# Altium schematic sheet 1_P1.schdoc
size 307 x 218 mm; Symbol: Sheet-Symbol_A4; Device: Sheet-Symbol_A4; Company: 嘉立创EDA; Version: V1.0; Page Size: A4; @Project Name: 250628 ESP32底板改版 120; @Page Count: 1; @Update Date: 2025-06-28; @Create Date: 2025-06-28; @Schematic Name: Schematic1_1; @Page No: 1; @Page Name: P1; Title Block Position: 3; Width: 1170; Height: 825; Region Start: 1; X Region Count: 6; Y Region Count: 4; Blade Width: 10; @Board Name: Board1_1; @Create Time: 22:15:55; @Update Time: 22:31:45
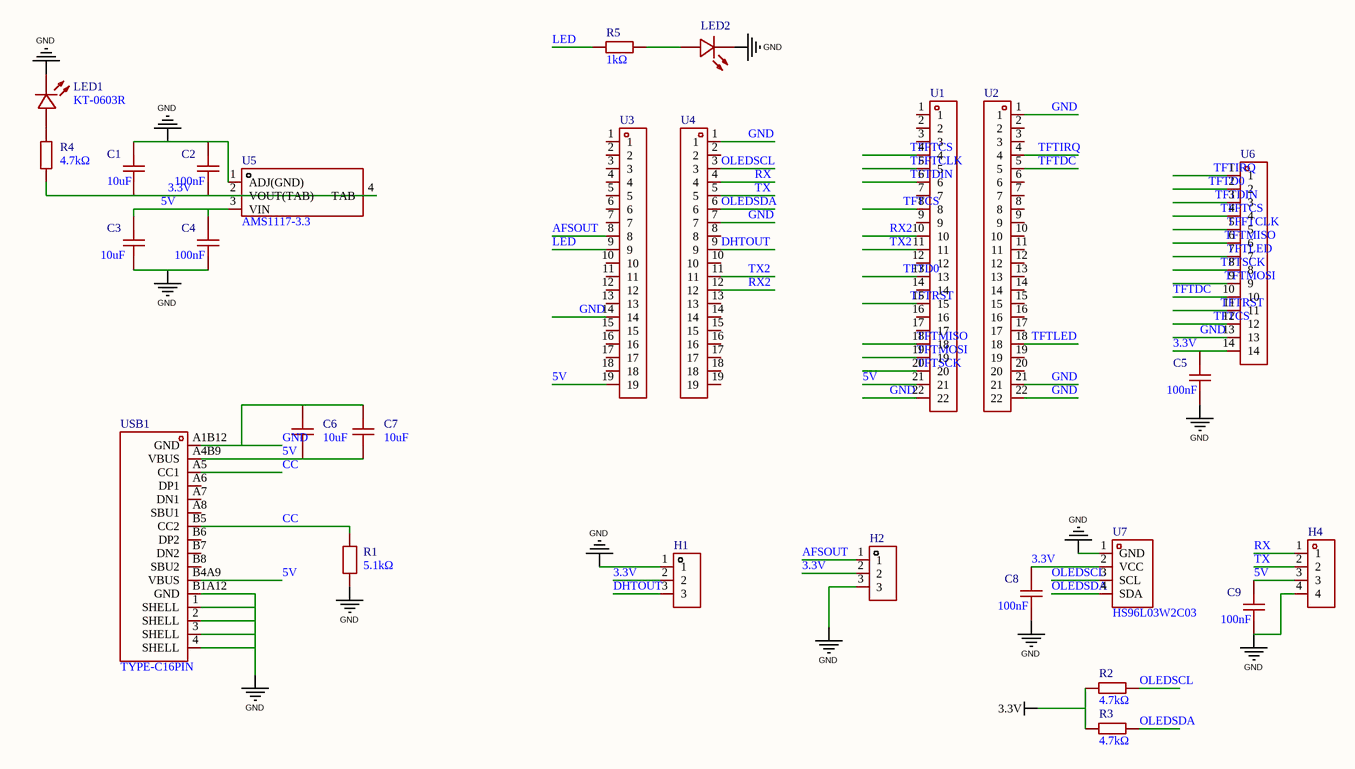
[diagram p0: 1_P1.schdoc]

## Parts
C1  10uF  [C0603]
C2  100nF  [C0603]
C3  10uF  [C0603]
C4  100nF  [C0603]
C5  100nF  [C0603]
C6  10uF  [C0603]
C7  10uF  [C0603]
C8  100nF  [C0603]
C9  100nF  [C0603]
H1  PM254V-11-03-H85  [HDR-TH_3P-P2.54-V-F]  (value not drawn)
H2  PM254V-11-03-H85  [HDR-TH_3P-P2.54-V-F]  (value not drawn)
H4  PZ254V-11-04P  [HDR-TH_4P-P2.54-V-M]  (value not drawn)
LED1  KT-0603R  [LED0603-RD]
LED2  KT-0603R  [LED0603-RD]  (value not drawn)
R1  5.1kΩ  [R0603]
R2  4.7kΩ  [R0603]
R3  4.7kΩ  [R0603]
R4  4.7kΩ  [R0603]
R5  1kΩ  [R0603]
U1  ZX-PM2.54-1-22PY  [HDR-TH_22P-P2.54-V-F]  (value not drawn)
U2  ZX-PM2.54-1-22PY  [HDR-TH_22P-P2.54-V-F]  (value not drawn)
U3  ZX-PM2.54-1-19PY  [HDR-TH_19P-P2.54-V-F]  (value not drawn)
U4  ZX-PM2.54-1-19PY  [HDR-TH_19P-P2.54-V-F]  (value not drawn)
U5  AMS1117-3.3  [SOT-223-4_L6.5-W3.5-P2.30-LS7.0-BR]
U6  PM254-1-14-Z-8.5  [HDR-TH_14P-P2.54-V-F-1]  (value not drawn)
U7  HS96L03W2C03  [OLED-TH_L27.8-W27.2-P2.54_C9900033791]
USB1  TYPE-C16PIN  [USB-C-SMD_TYPE-C16PIN]

## Nets
3.3V: C1.1 C2.1 C5.2 C8.2 H1.2 H2.2 R2.2 R3.2 R4.2 U5.2(VOUT(TAB)) U5.4(TAB) U6.14 U7.2(VCC)
GND: C1.2 C2.2 C3.1 C4.1 C5.1 C6.1 C7.1 C8.1 C9.1 H1.1 H2.3 H4.4 LED1.1(K) LED2.1(K) R1.1 U1.22 U2.1 U2.21 U2.22 U3.14 U4.1 U4.7 U5.1(ADJ(GND)) U6.13 U7.1(GND) USB1.1(SHELL) USB1.2(SHELL) USB1.3(SHELL) USB1.4(SHELL) USB1.A1B12(GND) USB1.B1A12(GND)
5V: C3.2 C4.2 C6.2 C7.2 C9.2 H4.3 U1.21 U3.19 U5.3(VIN) USB1.A4B9(VBUS) USB1.B4A9(VBUS)
AFSOUT: H2.1 U3.8
CC: R1.2 USB1.A5(CC1) USB1.B5(CC2)
DHTOUT: H1.3 U4.9
LED: R5.1 U3.9
OLEDSCL: R2.1 U4.3 U7.3(SCL)
OLEDSDA: R3.1 U4.6 U7.4(SDA)
RX: H4.1 U4.4
RX2: U1.10 U4.12
TFFTCLK: U1.5 U6.5
TFFTCS: U1.4 U6.4
TFTCS: U1.8 U6.12
TFTD0: U1.13 U6.2
TFTDC: U2.5 U6.10
TFTDIN: U1.6 U6.3
TFTIRQ: U2.4 U6.1
TFTLED: U2.18 U6.7
TFTMISO: U1.18 U6.6
TFTMOSI: U1.19 U6.9
TFTRST: U1.15 U6.11
TFTSCK: U1.20 U6.8
TX: H4.2 U4.5
TX2: U1.11 U4.11
NetLED1_2: LED1.2(A) R4.1
NetLED2_2: LED2.2(A) R5.2

Not connected (* = marked no-connect by the designer): U1 1 2 3 7 9 12 14 16 17; U2 2 3 6 7 8 9 10 11 12 13 14 15 16 17 19 20; U3 1 2 3 4 5 6 7 10 11 12 13 15 16 17 18; U4 2 8 10 13 14 15 16 17 18 19; USB1 A6(DP1) A7(DN1) A8(SBU1) B6(DP2) B7(DN2) B8(SBU2)

## Notes on the sheet
- 1
- 2
- 3
- 4
- 5
- 6
- A
- B
- C
- 原理图
- Schematic1_1
- 创建日期
- 更新日期
- 2025-06-28
- 绘制
- 图页
- P1
- 物料编码
- D
- 审阅
- 版本
- 尺寸
- 250628 ESP32底板改版 120
- 页
- 共
- V1.0
- A4
- 嘉立创EDA

## Library data of the parts
C1 C3 C6 C7 = CL10A106KP8NNNC: Manufacturer: SAMSUNG(三星); Add into BOM: yes; Tolerance: ±10%; Voltage Rated: 10V; Temperature Coefficient: X5R; Symbol: CL10A106KP8NNNC; Device: CL10A106KP8NNNC; LCSC Part Name: 10uF ±10% 10V; Supplier Part: C19702; Manufacturer Part: CL10A106KP8NNNC; Supplier Footprint: 0603; JLCPCB Part Class: 基础库; Datasheet: https://atta.szlcsc.com/upload/public/pdf/source/20160218/1457707763339.pdf; Supplier: LCSC; Convert to PCB: yes; Value: 10uF
C2 C4 C5 C8 C9 = CC0603KRX7R9BB104: Manufacturer: YAGEO(国巨); Add into BOM: yes; Tolerance: ±10%; Voltage Rated: 50V; Temperature Coefficient: X7R; Symbol: CC0603KRX7R9BB104; Device: CC0603KRX7R9BB104; LCSC Part Name: 100nF ±10% 50V; Supplier Part: C14663; Manufacturer Part: CC0603KRX7R9BB104; Supplier Footprint: 0603; JLCPCB Part Class: 基础库; Datasheet: https://atta.szlcsc.com/upload/public/pdf/source/20180910/C282072_33301C7F631E79921B82A8DAC6BCC5B3.pdf; Supplier: LCSC; Convert to PCB: yes; Value: 100nF
H1 H2 = PM254V-11-03-H85: Manufacturer: XFCN(兴飞); Add into BOM: yes; Holes Structure: 1x3P; Pitch: 2.54mm; Number of Holes: 3P; Symbol: PM254V-11-03-H85; Device: PM254V-11-03-H85; LCSC Part Name: 间距:2.54mm 1x3P 直插; Supplier Part: C541850; Manufacturer Part: PM254V-11-03-H85; Supplier Footprint: 插件,P=2.54mm; JLCPCB Part Class: 扩展库; Datasheet: https://atta.szlcsc.com/upload/public/pdf/source/20200518/C541849_85853D71FC67C51915A806977A588FDA.pdf; Supplier: LCSC; Convert to PCB: yes; Row Spacing: -; Mounting Type: 直插; Number of Rows: 单排; Insulation Height: -; Contact Material: 黄铜; Contact Plating: -
H4 = PZ254V-11-04P: Manufacturer: XFCN(兴飞); Symbol: PZ254V-11-04P_C2691448; Add into BOM: yes; Pin Structure: 1x4P; Pitch: 2.54mm; Circluar Pins/Square Pins: 方针; Current Rating (Max): 3A; Voltage Rating (Max): 250V; Device: PZ254V-11-04P; LCSC Part Name: 间距:2.54mm 1x4P 直插 方针; Supplier Part: C2691448; Manufacturer Part: PZ254V-11-04P; Supplier Footprint: 插件,P=2.54mm; JLCPCB Part Class: 扩展库; Datasheet: https://atta.szlcsc.com/upload/public/pdf/source/20200309/C492403_F9F19131791D08044AD4F84F8E751A34.pdf; Supplier: LCSC; Convert to PCB: yes; Row Spacing: -; Mounting Type: 直插; Number of Rows: 单排; Number of Pins: 4P; Length of Mating Pin: 6mm; Insulation Height: 2.5mm; Length of End Connection Pin: 3mm; Contact Material: -; Operating Temperature Range: -40℃~+105℃; Color: 黑色
LED1 LED2 = KT-0603R: Manufacturer: KENTO; Add into BOM: yes; Emitted Color: 红色; Symbol: KT-0603R; Device: KT-0603R; LCSC Part Name: 0603 红灯 高亮; Supplier Part: C2286; Manufacturer Part: KT-0603R; Supplier Footprint: 0603; JLCPCB Part Class: Basic Part; Datasheet: https://atta.szlcsc.com/upload/public/pdf/source/20160616/1466072038404.pdf; Supplier: LCSC; Convert to PCB: yes; Power Dissipation: -; Forward Current: -; Dominant Wavelength: -; Peak Wavelength: -; Diode Configuration: -; Lens Color: -; Color Temperature: -; Viewing Angle: -; Mounting Sytle: -; Operating Temperature: -40℃~+85℃
R1 = FRC0603F5101TS: Manufacturer: FOJAN(富捷); Add into BOM: yes; Tolerance: ±1%; Power(Watts): 100mW; Overload Voltage (Max): 75V; Temperature Coefficient: ±100ppm/℃; Symbol: FRC0603F5101TS; Device: FRC0603F5101TS; LCSC Part Name: 5.1kΩ ±1% 100mW 厚膜电阻; Supplier Part: C2907044; Manufacturer Part: FRC0603F5101TS; Supplier Footprint: 0603; JLCPCB Part Class: 扩展库; Datasheet: https://atta.szlcsc.com/upload/public/pdf/source/20211221/925EC7D7225764EE0046F22065062C87.pdf; Supplier: LCSC; Convert to PCB: yes; Type: 厚膜电阻; Value: 5.1kΩ; Operating Temperature Range: -55℃~+155℃
R2-R4 = 0603WAF4701T5E: Manufacturer: UNI-ROYAL(厚声); Add into BOM: yes; Tolerance: ±1%; Power(Watts): 100mW; Overload Voltage (Max): 75V; Temperature Coefficient: ±100ppm/℃; Symbol: 0603WAF4701T5E; Device: 0603WAF4701T5E; LCSC Part Name: 4.7kΩ ±1% 100mW 厚膜电阻; Supplier Part: C23162; Manufacturer Part: 0603WAF4701T5E; Supplier Footprint: 0603; JLCPCB Part Class: 基础库; Datasheet: https://atta.szlcsc.com/upload/public/pdf/source/20200306/C422600_1E6D84923E4A46A82E41ADD87F860B5C.pdf; Supplier: LCSC; Convert to PCB: yes; Type: 厚膜电阻; Value: 4.7kΩ; Operating Temperature Range: -55℃~+155℃
R5 = 0603WAF1001T5E: Manufacturer: UNI-ROYAL(厚声); Add into BOM: yes; Tolerance: ±1%; Power(Watts): 100mW; Overload Voltage (Max): 75V; Temperature Coefficient: ±100ppm/℃; Symbol: 0603WAF1001T5E; Device: 0603WAF1001T5E; LCSC Part Name: 1kΩ ±1% 100mW 厚膜电阻; Supplier Part: C21190; Manufacturer Part: 0603WAF1001T5E; Supplier Footprint: 0603; JLCPCB Part Class: 基础库; Datasheet: https://atta.szlcsc.com/upload/public/pdf/source/20200306/C422600_1E6D84923E4A46A82E41ADD87F860B5C.pdf; Supplier: LCSC; Convert to PCB: yes; Type: 厚膜电阻; Value: 1kΩ; Operating Temperature Range: -55℃~+155℃
U1 U2 = ZX-PM2.54-1-22PY: Manufacturer: Megastar(兆星); Add into BOM: yes; Holes Structure: 1x22P; Pitch: 2.54mm; Circular Hole / Square Hole: 方孔; Number of Holes: 22P; Voltage Rating (Max): 1kV; Holes Direction: 顶部; Soldering Temperature(Max): 260℃@5S; Symbol: ZX-PM2.54-1-22PY; Device: ZX-PM2.54-1-22PY; LCSC Part Name: 1x22P 间距:2.54mm 直插; Supplier Part: C7499337; Manufacturer Part: ZX-PM2.54-1-22PY; Supplier Footprint: 插件,P=2.54mm; JLCPCB Part Class: 扩展库; Datasheet: https://atta.szlcsc.com/upload/public/pdf/source/20231122/9A7AD1561672B326C4FDCF441604BC5A.pdf; Supplier: LCSC; Convert to PCB: yes; Row Spacing: -; Mounting Type: 直插; Number of Rows: 单排; Current Rating (Max): -; Insulation Height: 8.5mm; Contact Material: -; Contact Plating: 金; Operating Temperature Range: -40℃~+105℃
U3 U4 = ZX-PM2.54-1-19PY: Manufacturer: Megastar(兆星); Add into BOM: yes; Holes Structure: 1x19P; Pitch: 2.54mm; Circular Hole / Square Hole: 方孔; Number of Holes: 19P; Voltage Rating (Max): 1kV; Holes Direction: 顶部; Soldering Temperature(Max): 260℃@5S; Symbol: ZX-PM2.54-1-19PY; Device: ZX-PM2.54-1-19PY; LCSC Part Name: 1x19P 间距:2.54mm 直插; Supplier Part: C7499335; Manufacturer Part: ZX-PM2.54-1-19PY; Supplier Footprint: 插件,P=2.54mm; JLCPCB Part Class: 扩展库; Datasheet: https://atta.szlcsc.com/upload/public/pdf/source/20231122/4278E7E0F459AC6498D87D14C0E11918.pdf; Supplier: LCSC; Convert to PCB: yes; Row Spacing: -; Mounting Type: 直插; Number of Rows: 单排; Current Rating (Max): -; Insulation Height: 8.5mm; Contact Material: -; Contact Plating: 金; Operating Temperature Range: -40℃~+105℃
U5 = AMS1117-3.3_C347222: Manufacturer: UMW(友台半导体); Add into BOM: yes; Output Type: 固定; Voltage - Supply: 12V; Output Voltage: 3.3V; Output Current: 1A; Power Supply Rejection Ratio (PSRR): 60dB@(120Hz); Voltage Dropout: 1.3V@(1A); Output Configuration: 正极; Number of Outputs: 1; Symbol: AMS1117-3.3_C347222; Device: AMS1117-3.3_C347222; LCSC Part Name: 输出:3.3V 电流:1A 耐压:12V; Supplier Part: C347222; Manufacturer Part: AMS1117-3.3; Supplier Footprint: SOT-223; JLCPCB Part Class: 扩展库; Datasheet: https://atta.szlcsc.com/upload/public/pdf/source/20241218/BAF0263FA2E44BCD8AF41AA4FA04EFAA.pdf; Supplier: LCSC; Convert to PCB: yes; standby current: -; Noise: -; Features: 过流保护; Operating Temperature: -
U6 = PM254-1-14-Z-8.5: Manufacturer: HCTL(华灿天禄); Add into BOM: yes; Holes Structure: 1x14P; Pitch: 2.54mm; Circular Hole / Square Hole: 方孔; Number of Holes: 14P; Current Rating (Max): 3A; Holes Direction: 顶部; Soldering Temperature(Max): 260℃@5S; Symbol: PM254-1-14-Z-8.5; Device: PM254-1-14-Z-8.5; LCSC Part Name: 1x14P 间距:2.54mm 直插; Supplier Part: C2897377; Manufacturer Part: PM254-1-14-Z-8.5; Supplier Footprint: 插件,P=2.54mm; JLCPCB Part Class: 扩展库; Datasheet: https://atta.szlcsc.com/upload/public/pdf/source/20230609/534BE42964C679BDE98E061007C4ABD6.pdf; Supplier: LCSC; Convert to PCB: yes; Row Spacing: -; Mounting Type: 直插; Number of Rows: 单排; Voltage Rating (Max): -; Insulation Height: 8.5mm; Contact Material: 铜合金; Operating Temperature Range: -40℃~+105℃
U7 = HS96L03W2C03: Manufacturer: HS(汉昇); Add into BOM: yes; Main Control Chip: SSD1315; Interface Type: I2C; Pixel Resolution: 128x64; Symbol: HS96L03W2C03; Device: HS96L03W2C03; LCSC Part Name: 0.96寸OLED显示屏窄白光IIC; Supplier Part: C5248080; Manufacturer Part: HS96L03W2C03; Supplier Footprint: -; JLCPCB Part Class: 扩展库; Datasheet: https://atta.szlcsc.com/upload/public/pdf/source/20230627/763D01F79A90007632F098068C7C8AD9.pdf; Supplier: LCSC; Convert to PCB: yes; Size: 0.96; Operating Temperature: -40℃~+70℃
USB1 = TYPE-C16PIN: Manufacturer: SHOU HAN(首韩); Add into BOM: yes; Connector Type: Type-C; Gender: 母; Number of Contacts: 16P; Number of Ports: 1; Current Rating - Power (Max): 3A; Rated Voltage (Max): 30V; Connect-Disconnect Life: 1万次; Core Colour: 黑色; Symbol: TYPE-C16PIN; Device: TYPE-C16PIN; LCSC Part Name: Type-C 母 卧贴; Supplier Part: C393939; Manufacturer Part: TYPE-C16PIN; Supplier Footprint: SMD; JLCPCB Part Class: 扩展库; Datasheet: https://atta.szlcsc.com/upload/public/pdf/source/20190521/C393939_7B9043D4CF1026AF443AB60D91FBCD5C.pdf; Supplier: LCSC; Convert to PCB: yes; Standard: USB 3.1; Mounting Style: 卧贴; Operating Temperature Range: -40℃~+85℃